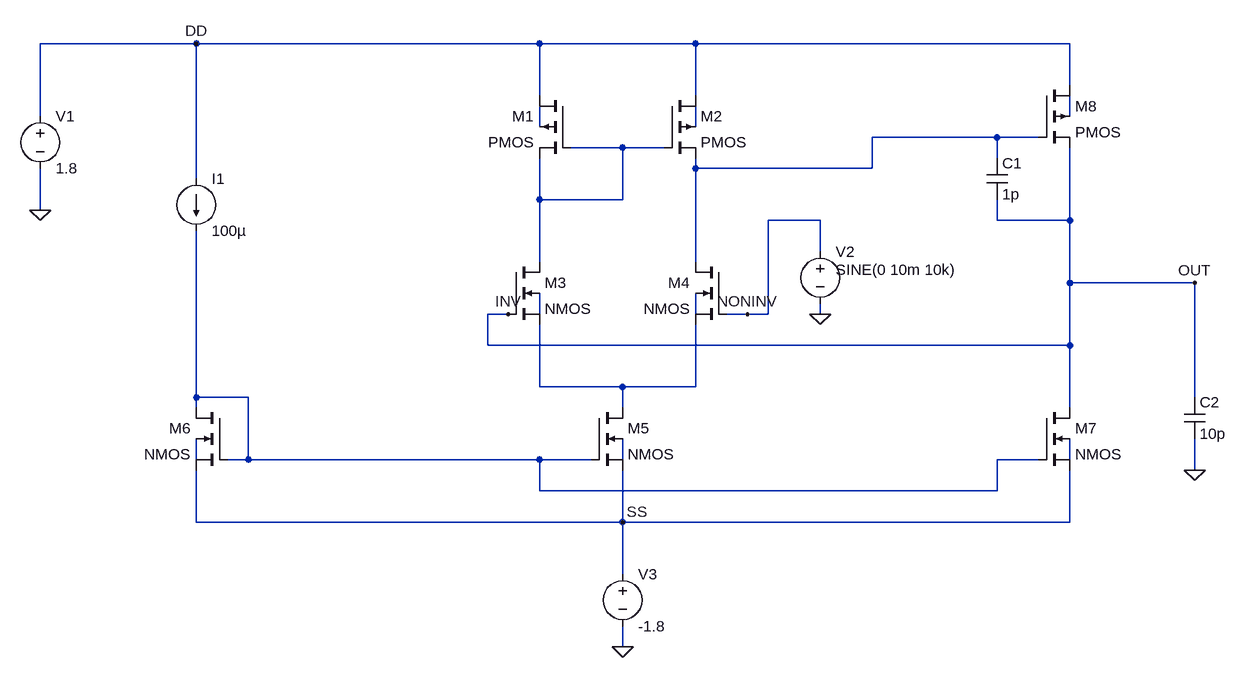
[diagram p0: schematic opamp_non-inverting.asc]
opamp_non-inverting.asc, the LTspice schematic file:
Version 4
SHEET 1 1736 888
WIRE 144 -80 -96 -80
WIRE 672 -80 144 -80
WIRE 912 -80 672 -80
WIRE 1488 -80 912 -80
WIRE 1488 -16 1488 -80
WIRE 672 0 672 -80
WIRE 912 0 912 -80
WIRE -96 32 -96 -80
WIRE 1488 32 1488 0
WIRE 672 48 672 16
WIRE 912 48 912 16
WIRE 1376 64 1184 64
WIRE 1440 64 1376 64
WIRE 800 80 720 80
WIRE 864 80 800 80
WIRE 1376 96 1376 64
WIRE 912 112 912 96
WIRE 1184 112 1184 64
WIRE 1184 112 912 112
WIRE 144 128 144 -80
WIRE 672 160 672 96
WIRE 800 160 800 80
WIRE 800 160 672 160
WIRE -96 176 -96 112
WIRE 1104 192 1024 192
WIRE 1376 192 1376 160
WIRE 1488 192 1488 80
WIRE 1488 192 1376 192
WIRE 1104 240 1104 192
WIRE 672 256 672 160
WIRE 912 256 912 112
WIRE 1488 288 1488 192
WIRE 1680 288 1488 288
WIRE 624 336 592 336
WIRE 672 336 672 304
WIRE 912 336 912 304
WIRE 992 336 960 336
WIRE 1024 336 1024 192
WIRE 1024 336 992 336
WIRE 1104 336 1104 320
WIRE 592 384 592 336
WIRE 1488 384 1488 288
WIRE 1488 384 592 384
WIRE 672 448 672 352
WIRE 800 448 672 448
WIRE 912 448 912 352
WIRE 912 448 800 448
WIRE 144 464 144 208
WIRE 224 464 144 464
WIRE 1680 464 1680 288
WIRE 144 480 144 464
WIRE 800 480 800 448
WIRE 1488 480 1488 384
WIRE 144 560 144 528
WIRE 224 560 224 464
WIRE 224 560 192 560
WIRE 672 560 224 560
WIRE 752 560 672 560
WIRE 800 560 800 528
WIRE 1440 560 1376 560
WIRE 1488 560 1488 528
WIRE 1680 576 1680 528
WIRE 672 608 672 560
WIRE 1376 608 1376 560
WIRE 1376 608 672 608
WIRE 144 656 144 576
WIRE 800 656 800 576
WIRE 800 656 144 656
WIRE 1488 656 1488 576
WIRE 1488 656 800 656
WIRE 800 736 800 656
WIRE 800 848 800 816
FLAG -96 176 0
FLAG 1680 576 0
FLAG 800 848 0
FLAG 144 -80 DD
FLAG 800 656 SS
FLAG 1680 288 OUT
FLAG 624 336 INV
FLAG 1104 336 0
FLAG 992 336 NONINV
SYMBOL voltage -96 16 R0
WINDOW 123 0 0 Left 0
WINDOW 39 0 0 Left 0
SYMATTR InstName V1
SYMATTR Value 1.8
SYMBOL current 144 128 R0
WINDOW 123 0 0 Left 0
WINDOW 39 0 0 Left 0
SYMATTR InstName I1
SYMATTR Value 100µ
SYMBOL pmos4 720 0 M0
SYMATTR InstName M1
SYMATTR Value2 l=180n w=4u
SYMBOL pmos4 864 0 R0
SYMATTR InstName M2
SYMATTR Value2 l=180n w=4u
SYMBOL nmos4 624 256 R0
SYMATTR InstName M3
SYMATTR Value2 l=180n w=4u
SYMBOL nmos4 960 256 M0
SYMATTR InstName M4
SYMATTR Value2 l=180n w=4u
SYMBOL nmos4 752 480 R0
SYMATTR InstName M5
SYMATTR Value2 l=180n w=4u
SYMBOL nmos4 192 480 M0
SYMATTR InstName M6
SYMATTR Value2 l=180n w=4u
SYMBOL nmos4 1440 480 R0
SYMATTR InstName M7
SYMATTR Value2 l=180n w=4u
SYMBOL pmos4 1440 -16 R0
SYMATTR InstName M8
SYMATTR Value2 l=180n w=4u
SYMBOL voltage 1104 224 R0
WINDOW 123 24 124 Left 2
WINDOW 39 0 0 Left 0
WINDOW 3 24 44 Left 2
SYMATTR Value SINE(0 10m 10k)
SYMATTR InstName V2
SYMBOL cap 1360 96 R0
SYMATTR InstName C1
SYMATTR Value 1p
SYMBOL cap 1664 464 R0
SYMATTR InstName C2
SYMATTR Value 10p
SYMBOL voltage 800 720 R0
WINDOW 123 0 0 Left 0
WINDOW 39 0 0 Left 0
SYMATTR InstName V3
SYMATTR Value -1.8

The netlist it stands for:
* opamp_non-inverting.asc
V1 DD 0 1.8
I1 DD N009 100µ
M1 DD N005 N005 N002 PMOS l=180n w=4u
M2 DD N005 N004 N003 PMOS l=180n w=4u
M3 N005 INV N008 N006 NMOS l=180n w=4u
M4 N004 NONINV N008 N007 NMOS l=180n w=4u
M5 N008 N009 SS N011 NMOS l=180n w=4u
M6 N009 N009 SS N010 NMOS l=180n w=4u
M7 INV N009 SS N012 NMOS l=180n w=4u
M8 DD N004 INV N001 PMOS l=180n w=4u
V2 NONINV 0 SINE(0 10m 10k)
C1 N004 INV 1p
C2 INV 0 10p
V3 SS 0 -1.8
.model NMOS NMOS
.model PMOS PMOS
.lib standard.mos
.backanno
.end